# Altium schematic sheet Sensors.SchDoc
size A3; Organization: Altium Limited; Address1: L3, 12a Rodborough Rd; Address2: Frenchs Forest; Address3: NSW; Address4: Australia 2086
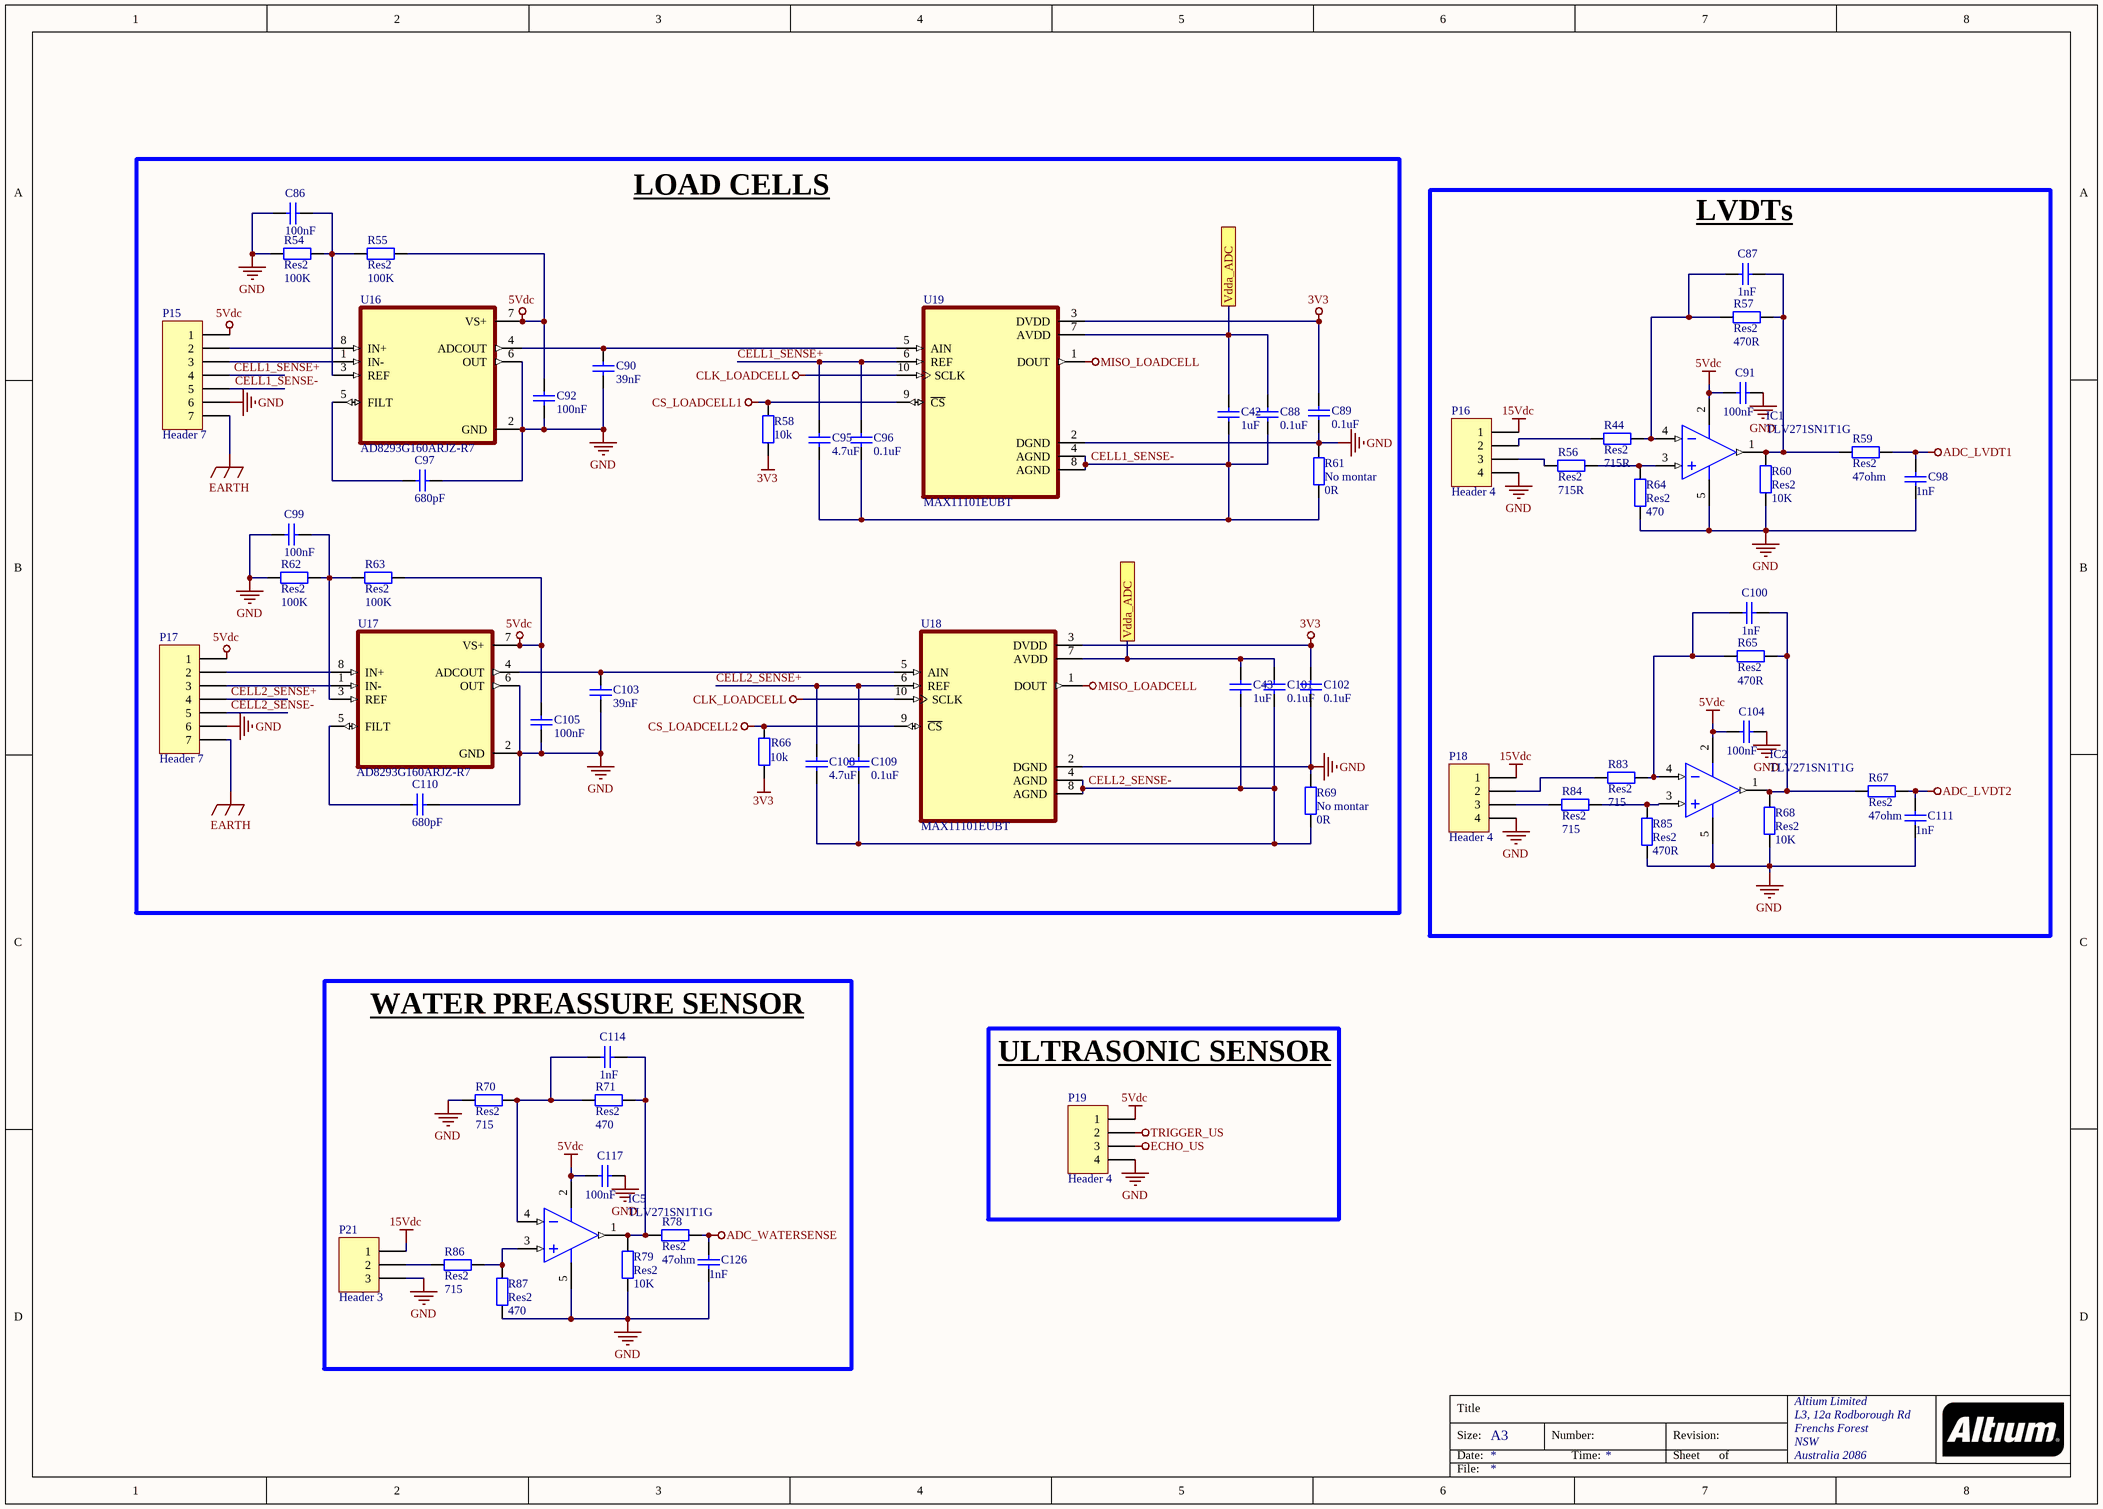
[diagram p0: Sensors.SchDoc]

## Parts
C42  value 1uF  [0603 - duplicate]  (hidden comment: Cap)
C43  value 1uF  [0603 - duplicate]  (hidden comment: Cap)
C86  value 100nF  [0603 - duplicate]  (hidden comment: Cap)
C87  value 1nF  [0603 - duplicate]  (hidden comment: Cap)
C88  value 0.1uF  [0603 - duplicate]  (hidden comment: Cap)
C89  value 0.1uF  [0603 - duplicate]  (hidden comment: Cap)
C90  value 39nF  [0603 - duplicate]  (hidden comment: Cap)
C91  value 100nF  [0603 - duplicate]  (hidden comment: Cap)
C92  value 100nF  [0603 - duplicate]  (hidden comment: Cap)
C95  value 4.7uF  [0603 - duplicate]  (hidden comment: Cap)
C96  value 0.1uF  [0603 - duplicate]  (hidden comment: Cap)
C97  value 680pF  [0603 - duplicate]  (hidden comment: Cap)
C98  value 1nF  [0603 - duplicate]  (hidden comment: Cap)
C99  value 100nF  [0603 - duplicate]  (hidden comment: Cap)
C100  value 1nF  [0603 - duplicate]  (hidden comment: Cap)
C101  value 0.1uF  [0603 - duplicate]  (hidden comment: Cap)
C102  value 0.1uF  [0603 - duplicate]  (hidden comment: Cap)
C103  value 39nF  [0603 - duplicate]  (hidden comment: Cap)
C104  value 100nF  [0603 - duplicate]  (hidden comment: Cap)
C105  value 100nF  [0603 - duplicate]  (hidden comment: Cap)
C108  value 4.7uF  [0603 - duplicate]  (hidden comment: Cap)
C109  value 0.1uF  [0603 - duplicate]  (hidden comment: Cap)
C110  value 680pF  [0603 - duplicate]  (hidden comment: Cap)
C111  value 1nF  [0603 - duplicate]  (hidden comment: Cap)
C114  value 1nF  [0603 - duplicate]  (hidden comment: Cap)
C117  value 100nF  [0603 - duplicate]  (hidden comment: Cap)
C126  value 1nF  [0603 - duplicate]  (hidden comment: Cap)
IC1  TLV271SN1T1G  [SOT23-5_N]
IC2  TLV271SN1T1G  [SOT23-5_N]
IC5  TLV271SN1T1G  [SOT23-5_N]
P15  Header 7  [regleta_7]
P16  Header 4  [regleta_4]
P17  Header 7  [regleta_7]
P18  Header 4  [regleta_4]
P19  Header 4  [regleta_4]
P21  Header 3  [regleta_3]
R44  Res2  value 715R  [0603 - duplicate]
R54  Res2  value 100K  [0603 - duplicate]
R55  Res2  value 100K  [0603 - duplicate]
R56  Res2  value 715R  [0603 - duplicate]
R57  Res2  value 470R  [0603 - duplicate]
R58  10k  [0603 - duplicate]
R59  Res2  value 47ohm  [0603 - duplicate]
R60  Res2  value 10K  [0603 - duplicate]
R61  No montar  value 0R  [0603 - duplicate]
R62  Res2  value 100K  [0603 - duplicate]
R63  Res2  value 100K  [0603 - duplicate]
R64  Res2  value 470  [0603 - duplicate]
R65  Res2  value 470R  [0603 - duplicate]
R66  10k  [0603 - duplicate]
R67  Res2  value 47ohm  [0603 - duplicate]
R68  Res2  value 10K  [0603 - duplicate]
R69  No montar  value 0R  [0603 - duplicate]
R70  Res2  value 715  [0603 - duplicate]
R71  Res2  value 470  [0603 - duplicate]
R78  Res2  value 47ohm  [0603 - duplicate]
R79  Res2  value 10K  [0603 - duplicate]
R83  Res2  value 715  [0603 - duplicate]
R84  Res2  value 715  [0603 - duplicate]
R85  Res2  value 470R  [0603 - duplicate]
R86  Res2  value 715  [0603 - duplicate]
R87  Res2  value 470  [0603 - duplicate]
U16  AD8293G160ARJZ-R7  [SOT65P280X145-8N]
U17  AD8293G160ARJZ-R7  [SOT65P280X145-8N]
U18  MAX11101EUBT  [SOP50P490X110-10N]
U19  MAX11101EUBT  [SOP50P490X110-10N]

## Blocks framed on the sheet
LOAD CELLS: C42 C43 C86 C88-C90 C92 C95-C97 C99 C101-C103 C105 C108-C110 P15 P17 R54 R55 R58 R61-R63 R66 R69 U16-U19
LVDTs: C87 C91 C98 C100 C104 C111 IC1 IC2 P16 P18 R44 R56 R57 R59 R60 R64 R65 R67 R68 R83-R85
WATER PREASSURE SENSOR: C114 C117 C126 IC5 P21 R70 R71 R78 R79 R86 R87
ULTRASONIC SENSOR: P19

## Ports
Vdda_ADC

## Nets
3V3: C89.2 C102.2 R58.2 R66.2 U18.3(DVDD) U19.3(DVDD)
5Vdc: C91.1 C92.2 C104.1 C105.2 C117.1 IC1.2(V+) IC2.2(V+) IC5.2(V+) P15.1 P17.1 P19.1 R55.1 R63.1 U16.7(VS+) U17.7(VS+)
15Vdc: P16.1 P18.1 P21.1
ADC_LVDT1: C98.2 R59.1
ADC_LVDT2: C111.2 R67.1
ADC_WATERSENSE: C126.2 R78.1
CLK_LOADCELL: U18.10(SCLK) U19.10(SCLK)
CS_LOADCELL1: R58.1 U19.9(~{CS})
CS_LOADCELL2: R66.1 U18.9(~{CS})
EARTH: P15.7 P17.7
ECHO_US: P19.3
GND: C86.2 C89.1 C90.1 C91.2 C92.1 C97.1 C98.1 C99.2 C102.1 C103.1 C104.2 C105.1 C110.1 C111.1 C117.2 C126.1 IC1.5(V-) IC2.5(V-) IC5.5(V-) P15.6 P16.4 P17.6 P18.4 P19.4 P21.3 R54.2 R60.1 R61.2 R62.2 R64.2 R68.1 R69.2 R70.2 R79.1 R85.2 R87.2 U16.2(GND) U16.6(OUT) U17.2(GND) U17.6(OUT) U18.2(DGND) U19.2(DGND)
MISO_LOADCELL: U18.1(DOUT) U19.1(DOUT)
TRIGGER_US: P19.2
CELL1_SENSE+: C95.2 C96.2 P15.4 U19.6(REF)
CELL1_SENSE-: C42.1 C88.1 C95.1 C96.1 P15.5 R61.1 U19.4(AGND) U19.8(AGND)
CELL2_SENSE+: C108.2 C109.2 P17.4 U18.6(REF)
CELL2_SENSE-: C43.1 C101.1 C108.1 C109.1 P17.5 R69.1 U18.4(AGND) U18.8(AGND)
Vdda_ADC: C42.2 C43.2 C88.2 C101.2 U18.7(AVDD) U19.7(AVDD) ; port Vdda_ADC
NetC86_1: C86.1 R54.1 R55.2 U16.3(REF)
NetC87_1: C87.1 IC1.1(OUT) R57.1 R59.2 R60.2
NetC87_2: C87.2 IC1.4(IN-) R44.1 R57.2
NetC90_2: C90.2 U16.4(ADCOUT) U19.5(AIN)
NetC97_2: C97.2 U16.5(FILT)
NetC99_1: C99.1 R62.1 R63.2 U17.3(REF)
NetC100_1: C100.1 IC2.1(OUT) R65.1 R67.2 R68.2
NetC100_2: C100.2 IC2.4(IN-) R65.2 R83.1
NetC103_2: C103.2 U17.4(ADCOUT) U18.5(AIN)
NetC110_2: C110.2 U17.5(FILT)
NetC114_1: C114.1 IC5.1(OUT) R71.1 R78.2 R79.2
NetC114_2: C114.2 IC5.4(IN-) R70.1 R71.2
NetIC1_3: IC1.3(IN+) R56.1 R64.1
NetIC2_3: IC2.3(IN+) R84.1 R85.1
NetIC5_3: IC5.3(IN+) R86.1 R87.1
NetP15_2: P15.2 U16.8(IN+)
NetP15_3: P15.3 U16.1(IN-)
NetP16_2: P16.2 R44.2
NetP16_3: P16.3 R56.2
NetP17_2: P17.2 U17.8(IN+)
NetP17_3: P17.3 U17.1(IN-)
NetP18_2: P18.2 R83.2
NetP18_3: P18.3 R84.2
NetP21_2: P21.2 R86.2

## Notes on the sheet
- Load cells will give a 2mV/V output, so with a 5V excitation and maxium load applied (200N), the output will be 20mV. We need to adapt this signal to be read by the ADC, so we will use an instrumentation amplifier.
- LVDTs will give an output between 0V to 5V depending on the extension of the core. We need to reduce the maximum value of 5 V to 3.3V, because pins of the MCU have a maximum tolerance. We need to use a differential amplifier to achieve that, cause the sensor will give two outputs, and we should amplify the difference between them.
- (near R70) Water sensor output is 0V to 5V. We need to reduce this value because adc pins are 3.6 tolerant. We use a resistence divisor for this purpose, and a follower because the signal will have a good voltage level but will be low power, so it can be affected by the ADC pin.
- Title
- Size:
- Date:
- A3
- Number:
- Time:
- Revision:
- Sheet
- of
- File:

## Library data of the parts
C42 C43 C86-C92 C95-C105 C108-C111 C114 C117 C126 = Cap: Capacitor; Published: 8-Jun-2000; LatestRevisionDate: 17-Jul-2002; LatestRevisionNote: Re-released for DXP Platform.; PackageReference: RAD-0.3; Publisher: Altium Limited; PackageDescription: Radial Cap, Thru-Hole; 2 Leads; 0.3 in Pin Spacing
IC1 IC2 IC5 = TLV271SN1T1G: Operational Amplifier; Published: 8-Jun-2000; LatestRevisionDate: 17-Jul-2002; LatestRevisionNote: Re-released for DXP Platform.; DatasheetVersion: REV. B; PackageVersion: 1990; PackageReference: H-08A; Publisher: Altium Limited; PackageDescription: Can; 8 Leads; Pin Circle Dia. 5.08 mm; Lead Dia. 0.53 mm (max); ComponentLink1Description: Manufacturer Link; ComponentLink1URL: http://www.analog.com/
P15 P17 = Header 7: Header, 7-Pin; LatestRevisionDate: 17-Jul-2002; LatestRevisionNote: Re-released for DXP Platform.; Publisher: Altium Limited
P16 P18 P19 = Header 4: Header, 4-Pin; LatestRevisionDate: 17-Jul-2002; LatestRevisionNote: Re-released for DXP Platform.; Publisher: Altium Limited
P21 = Header 3: Header, 3-Pin; LatestRevisionDate: 17-Jul-2002; LatestRevisionNote: Re-released for DXP Platform.; Publisher: Altium Limited
R44 R54-R71 R78 R79 R83-R87 = Res2: Resistor; Published: 8-Jun-2000; LatestRevisionDate: 17-Jul-2002; LatestRevisionNote: Re-released for DXP Platform.; PackageReference: AXIAL-0.4; Publisher: Altium Limited; PackageDescription: Axial Device, Thru-Hole; 2 Leads; 0.4 in Pin Spacing
U16 U17 = AD8293G160ARJZ-R7: Instrumentation Amplifier 1 Circuit Rail-to-Rail SOT-23-8; MF: Analog Devices; Check_prices: https://www.snapeda.com/parts/AD8293G160ARJZ-R7/Analog+Devices/view-part/?ref=eda; Value: *; Availability: In Stock; Price: None; Package: SOT-8 Analog Devices; MP: AD8293G160ARJZ-R7; Purchase-URL: https://pricing.snapeda.com/search/part/AD8293G160ARJZ-R7/?ref=eda; SnapEDA_Link: https://www.snapeda.com/parts/AD8293G160ARJZ-R7/Analog+Devices/view-part/?ref=snap
U18 U19 = MAX11101EUBT: Data acquisition IC - AD converter _ADC_ Maxim Integrated MAX11101EUB+T External uMAX 10; Value: *; MP: MAX11101EUB+T; Package: uMAX-10 Maxim; MF: Maxim Integrated; Price: None; Availability: Unavailable; SnapEDA_Link: https://www.snapeda.com/parts/MAX11101EUB%2BT/Maxim%20Integrated/view-part/693032/?ref=snap